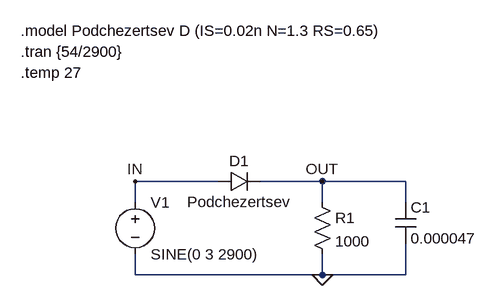
[diagram p0: schematic Draft2.B.47.asc]
Draft2.B.47.asc, the LTspice schematic file:
Version 4
SHEET 1 161040 680
WIRE 192 224 64 224
WIRE 352 224 256 224
WIRE 480 224 352 224
WIRE 64 256 64 224
WIRE 352 256 352 224
WIRE 480 256 480 224
WIRE 64 368 64 336
WIRE 352 368 352 336
WIRE 352 368 64 368
WIRE 480 368 480 320
WIRE 480 368 352 368
FLAG 352 368 0
FLAG 64 224 IN
FLAG 352 224 OUT
SYMBOL diode 192 240 R270
WINDOW 0 32 32 VTop 2
WINDOW 3 0 32 VBottom 2
SYMATTR InstName D1
SYMATTR Value Podchezertsev
SYMBOL voltage 64 240 R0
WINDOW 123 0 0 Left 0
WINDOW 39 0 0 Left 0
SYMATTR InstName V1
SYMATTR Value SINE(0 3 2900)
SYMBOL res 336 240 R0
SYMATTR InstName R1
SYMATTR Value 1000
SYMBOL cap 464 256 R0
SYMATTR InstName C1
SYMATTR Value 0.000047
TEXT -112 -8 Left 2 !.model Podchezertsev D (IS=0.02n N=1.3 RS=0.65)
TEXT -112 24 Left 2 !.tran {54/2900}
TEXT -112 56 Left 2 !.temp 27

The netlist it stands for:
* Draft2.B.47.asc
D1 IN OUT Podchezertsev
V1 IN 0 SINE(0 3 2900)
R1 OUT 0 1000
C1 OUT 0 0.000047
.model D D
.lib standard.dio
.model Podchezertsev D (IS=0.02n N=1.3 RS=0.65)
.tran {54/2900}
.temp 27
.backanno
.end